# Altium schematic sheet Main.SchDoc
size A3; SheetNumber: 1; SheetTotal: 1
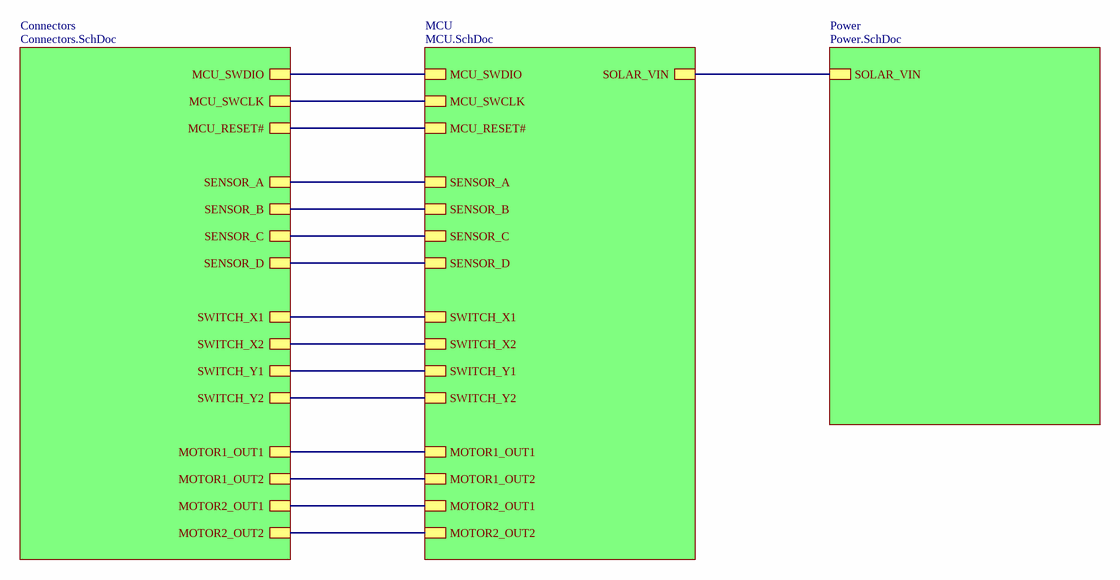
[diagram p0: Main.SchDoc]

## Sub-sheets
Connectors = Connectors.SchDoc: MCU_SWDIO, MCU_SWCLK, MCU_RESET#, SENSOR_A, SENSOR_B, SENSOR_C, SENSOR_D, SWITCH_X1, SWITCH_X2, SWITCH_Y1, SWITCH_Y2, MOTOR1_OUT1, MOTOR1_OUT2, MOTOR2_OUT1, MOTOR2_OUT2
MCU = MCU.SchDoc: MCU_SWDIO, MCU_SWCLK, MCU_RESET#, SOLAR_VIN, SENSOR_A, SENSOR_B, SENSOR_C, SENSOR_D, SWITCH_X1, SWITCH_X2, SWITCH_Y1, SWITCH_Y2, MOTOR1_OUT1, MOTOR1_OUT2, MOTOR2_OUT1, MOTOR2_OUT2
Power = Power.SchDoc: SOLAR_VIN

## Nets
(unnamed): sheet Connectors/MCU_SWDIO, sheet MCU/MCU_SWDIO
(unnamed): sheet Connectors/MCU_SWCLK, sheet MCU/MCU_SWCLK
(unnamed): sheet Connectors/MCU_RESET#, sheet MCU/MCU_RESET#
(unnamed): sheet Connectors/SENSOR_A, sheet MCU/SENSOR_A
(unnamed): sheet Connectors/SENSOR_B, sheet MCU/SENSOR_B
(unnamed): sheet Connectors/SENSOR_C, sheet MCU/SENSOR_C
(unnamed): sheet Connectors/SENSOR_D, sheet MCU/SENSOR_D
(unnamed): sheet Connectors/SWITCH_X1, sheet MCU/SWITCH_X1
(unnamed): sheet Connectors/SWITCH_X2, sheet MCU/SWITCH_X2
(unnamed): sheet Connectors/SWITCH_Y1, sheet MCU/SWITCH_Y1
(unnamed): sheet Connectors/SWITCH_Y2, sheet MCU/SWITCH_Y2
(unnamed): sheet Connectors/MOTOR1_OUT1, sheet MCU/MOTOR1_OUT1
(unnamed): sheet Connectors/MOTOR1_OUT2, sheet MCU/MOTOR1_OUT2
(unnamed): sheet Connectors/MOTOR2_OUT1, sheet MCU/MOTOR2_OUT1
(unnamed): sheet Connectors/MOTOR2_OUT2, sheet MCU/MOTOR2_OUT2
(unnamed): sheet MCU/SOLAR_VIN, sheet Power/SOLAR_VIN